# Altium schematic sheet Sheet2.SchDoc
size A2; SheetNumber: 1; SheetTotal: 1
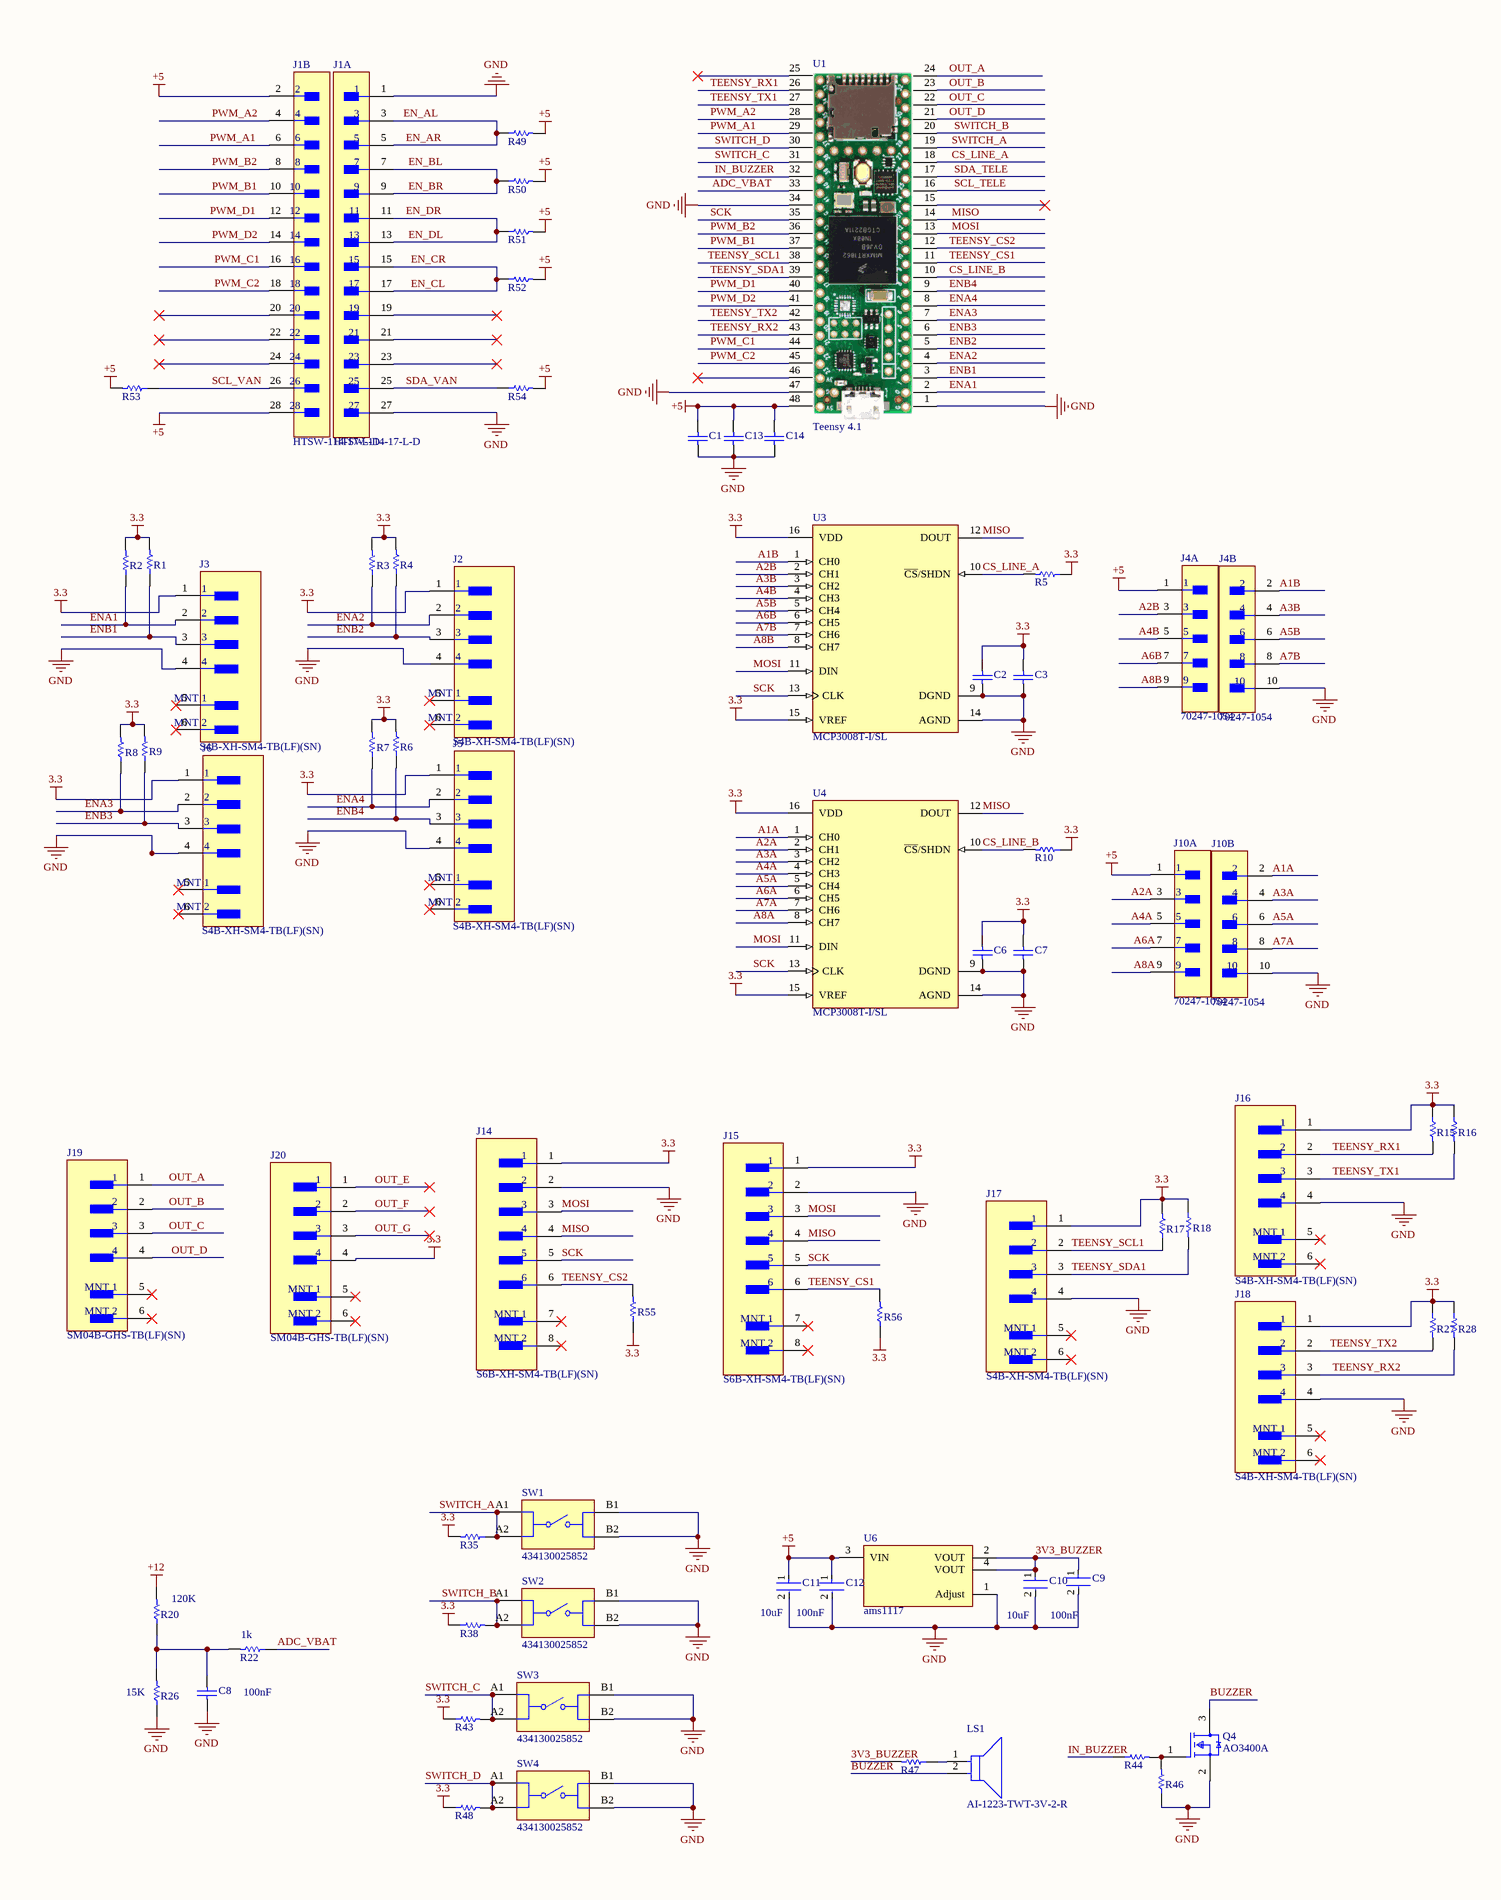
[diagram p0: Sheet2.SchDoc, left]
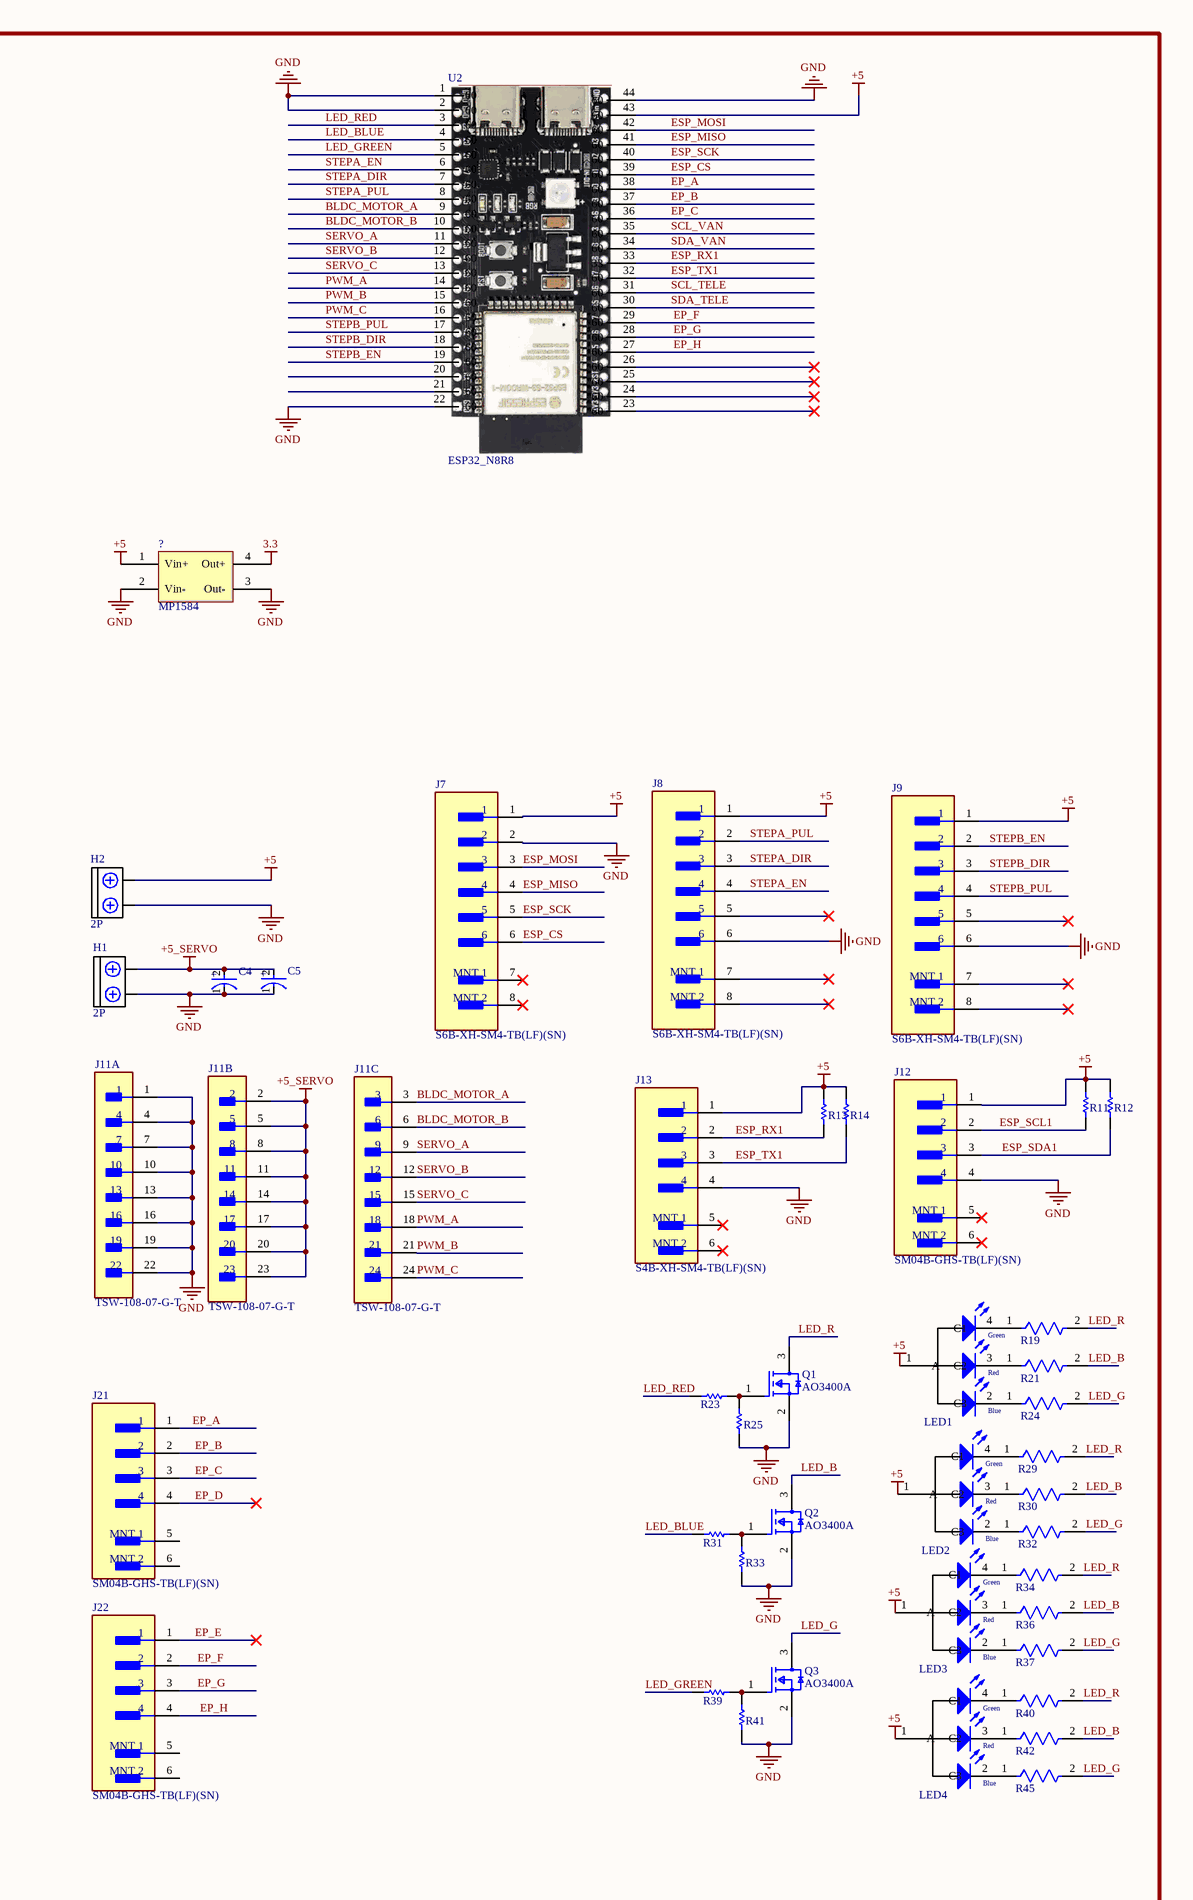
[diagram p1: Sheet2.SchDoc, right]

## Parts
?  MP1584  [MP1584]
C1  VJ0805Y104MXAMT  [CAPC2013X145X48LL20T23]  (value not drawn)
C2  VJ0805Y104MXAMT  [CAPC2013X145X48LL20T23]  (value not drawn)
C3  VJ0805Y104MXAMT  [CAPC2013X145X48LL20T23]  (value not drawn)
C4  100SXV15MX  [FP-OS-CON-SMT-F8-MFG]  (value not drawn)
C5  100SXV15MX  [FP-OS-CON-SMT-F8-MFG]  (value not drawn)
C6  VJ0805Y104MXAMT  [CAPC2013X145X48LL20T23]  (value not drawn)
C7  VJ0805Y104MXAMT  [CAPC2013X145X48LL20T23]  (value not drawn)
C8  VJ0805Y104MXAMT  [CAPC2013X145X48LL20T23]  (value not drawn)
C9  12061A101JAT2A  [FP-1206-L_3_2_0_2-W_1_6_0-MFG]  (value not drawn)
C10  12061A101JAT2A  [FP-1206-L_3_2_0_2-W_1_6_0-MFG]  (value not drawn)
C11  12061A101JAT2A  [FP-1206-L_3_2_0_2-W_1_6_0-MFG]  (value not drawn)
C12  12061A101JAT2A  [FP-1206-L_3_2_0_2-W_1_6_0-MFG]  (value not drawn)
C13  VJ0805Y104MXAMT  [CAPC2013X145X48LL20T23]  (value not drawn)
C14  VJ0805Y104MXAMT  [CAPC2013X145X48LL20T23]  (value not drawn)
H1  2P  [KF128-2P]
H2  2P  [KF128-2P]
J1  HTSW-114-17-L-D  [FP-HTSW-114-17-L-D-MFG]  (parts A,B of 2)
J2  S4B-XH-SM4-TB(LF)(SN)  [FP-S4B-XH-SM4-TB_LF_SN-MFG]
J3  S4B-XH-SM4-TB(LF)(SN)  [FP-S4B-XH-SM4-TB_LF_SN-MFG]
J4  70247-1054  [FP-70247-1054-MFG]  (parts A,B of 2)
J5  S4B-XH-SM4-TB(LF)(SN)  [FP-S4B-XH-SM4-TB_LF_SN-MFG]
J6  S4B-XH-SM4-TB(LF)(SN)  [FP-S4B-XH-SM4-TB_LF_SN-MFG]
J7  S6B-XH-SM4-TB(LF)(SN)  [FP-S6B-XH-SM4-TB_LF_SN-MFG]
J8  S6B-XH-SM4-TB(LF)(SN)  [FP-S6B-XH-SM4-TB_LF_SN-MFG]
J9  S6B-XH-SM4-TB(LF)(SN)  [FP-S6B-XH-SM4-TB_LF_SN-MFG]
J10  70247-1054  [FP-70247-1054-MFG]  (parts A,B of 2)
J11  TSW-108-07-G-T  [FP-TSW-108-07-G-T-MFG]  (parts A,B,C of 3)
J12  SM04B-GHS-TB(LF)(SN)  [FP-SM04B-GHS-TB_LF_SN-MFG]
J13  S4B-XH-SM4-TB(LF)(SN)  [FP-S4B-XH-SM4-TB_LF_SN-MFG]
J14  S6B-XH-SM4-TB(LF)(SN)  [FP-S6B-XH-SM4-TB_LF_SN-MFG]
J15  S6B-XH-SM4-TB(LF)(SN)  [FP-S6B-XH-SM4-TB_LF_SN-MFG]
J16  S4B-XH-SM4-TB(LF)(SN)  [FP-S4B-XH-SM4-TB_LF_SN-MFG]
J17  S4B-XH-SM4-TB(LF)(SN)  [FP-S4B-XH-SM4-TB_LF_SN-MFG]
J18  S4B-XH-SM4-TB(LF)(SN)  [FP-S4B-XH-SM4-TB_LF_SN-MFG]
J19  SM04B-GHS-TB(LF)(SN)  [FP-SM04B-GHS-TB_LF_SN-MFG]
J20  SM04B-GHS-TB(LF)(SN)  [FP-SM04B-GHS-TB_LF_SN-MFG]
J21  SM04B-GHS-TB(LF)(SN)  [FP-SM04B-GHS-TB_LF_SN-MFG]
J22  SM04B-GHS-TB(LF)(SN)  [FP-SM04B-GHS-TB_LF_SN-MFG]
LED1  150141M173100  [LED RGB 3528]  (value not drawn)
LED2  150141M173100  [LED RGB 3528]  (value not drawn)
LED3  150141M173100  [LED RGB 3528]  (value not drawn)
LED4  150141M173100  [LED RGB 3528]  (value not drawn)
LS1  AI-1223-TWT-3V-2-R  [FP-AI-1223-TWT-3V-2-R-MFG]
Q1  AO3400A  [FP-SOT23-MFG]
Q2  AO3400A  [FP-SOT23-MFG]
Q3  AO3400A  [FP-SOT23-MFG]
Q4  AO3400A  [FP-SOT23-MFG]
R1  CRCW08051K00FKTC  [RESC2013X50X30ML20T20]  (value not drawn)
R2  CRCW08051K00FKTC  [RESC2013X50X30ML20T20]  (value not drawn)
R3  CRCW08051K00FKTC  [RESC2013X50X30ML20T20]  (value not drawn)
R4  CRCW08051K00FKTC  [RESC2013X50X30ML20T20]  (value not drawn)
R5  CRCW08051K00FKTC  [RESC2013X50X30ML20T20]  (value not drawn)
R6  CRCW08051K00FKTC  [RESC2013X50X30ML20T20]  (value not drawn)
R7  CRCW08051K00FKTC  [RESC2013X50X30ML20T20]  (value not drawn)
R8  CRCW08051K00FKTC  [RESC2013X50X30ML20T20]  (value not drawn)
R9  CRCW08051K00FKTC  [RESC2013X50X30ML20T20]  (value not drawn)
R10  CRCW08051K00FKTC  [RESC2013X50X30ML20T20]  (value not drawn)
R11  CRCW08051K00FKTC  [RESC2013X50X30ML20T20]  (value not drawn)
R12  CRCW08051K00FKTC  [RESC2013X50X30ML20T20]  (value not drawn)
R13  CRCW08051K00FKTC  [RESC2013X50X30ML20T20]  (value not drawn)
R14  CRCW08051K00FKTC  [RESC2013X50X30ML20T20]  (value not drawn)
R15  CRCW08051K00FKTC  [RESC2013X50X30ML20T20]  (value not drawn)
R16  CRCW08051K00FKTC  [RESC2013X50X30ML20T20]  (value not drawn)
R17  CRCW08051K00FKTC  [RESC2013X50X30ML20T20]  (value not drawn)
R18  CRCW08051K00FKTC  [RESC2013X50X30ML20T20]  (value not drawn)
R19  RT0805FRE07330RL  [FP-RT0805-MFG]  (value not drawn)
R20  CRCW08051K00FKTC  [RESC2013X50X30ML20T20]  (value not drawn)
R21  RT0805FRE07330RL  [FP-RT0805-MFG]  (value not drawn)
R22  CRCW08051K00FKTC  [RESC2013X50X30ML20T20]  (value not drawn)
R23  CRCW08051K00FKTC  [RESC2013X50X30ML20T20]  (value not drawn)
R24  RT0805FRE07330RL  [FP-RT0805-MFG]  (value not drawn)
R25  CRCW08051K00FKTC  [RESC2013X50X30ML20T20]  (value not drawn)
R26  CRCW08051K00FKTC  [RESC2013X50X30ML20T20]  (value not drawn)
R27  CRCW08051K00FKTC  [RESC2013X50X30ML20T20]  (value not drawn)
R28  CRCW08051K00FKTC  [RESC2013X50X30ML20T20]  (value not drawn)
R29  RT0805FRE07330RL  [FP-RT0805-MFG]  (value not drawn)
R30  RT0805FRE07330RL  [FP-RT0805-MFG]  (value not drawn)
R31  CRCW08051K00FKTC  [RESC2013X50X30ML20T20]  (value not drawn)
R32  RT0805FRE07330RL  [FP-RT0805-MFG]  (value not drawn)
R33  CRCW08051K00FKTC  [RESC2013X50X30ML20T20]  (value not drawn)
R34  RT0805FRE07330RL  [FP-RT0805-MFG]  (value not drawn)
R35  CRCW08051K00FKTC  [RESC2013X50X30ML20T20]  (value not drawn)
R36  RT0805FRE07330RL  [FP-RT0805-MFG]  (value not drawn)
R37  RT0805FRE07330RL  [FP-RT0805-MFG]  (value not drawn)
R38  CRCW08051K00FKTC  [RESC2013X50X30ML20T20]  (value not drawn)
R39  CRCW08051K00FKTC  [RESC2013X50X30ML20T20]  (value not drawn)
R40  RT0805FRE07330RL  [FP-RT0805-MFG]  (value not drawn)
R41  CRCW08051K00FKTC  [RESC2013X50X30ML20T20]  (value not drawn)
R42  RT0805FRE07330RL  [FP-RT0805-MFG]  (value not drawn)
R43  CRCW08051K00FKTC  [RESC2013X50X30ML20T20]  (value not drawn)
R44  CRCW08051K00FKTC  [RESC2013X50X30ML20T20]  (value not drawn)
R45  RT0805FRE07330RL  [FP-RT0805-MFG]  (value not drawn)
R46  CRCW08051K00FKTC  [RESC2013X50X30ML20T20]  (value not drawn)
R47  CRCW08051K00FKTC  [RESC2013X50X30ML20T20]  (value not drawn)
R48  CRCW08051K00FKTC  [RESC2013X50X30ML20T20]  (value not drawn)
R49  CRCW08051K00FKTC  [RESC2013X50X30ML20T20]  (value not drawn)
R50  CRCW08051K00FKTC  [RESC2013X50X30ML20T20]  (value not drawn)
R51  CRCW08051K00FKTC  [RESC2013X50X30ML20T20]  (value not drawn)
R52  CRCW08051K00FKTC  [RESC2013X50X30ML20T20]  (value not drawn)
R53  CRCW08051K00FKTC  [RESC2013X50X30ML20T20]  (value not drawn)
R54  CRCW08051K00FKTC  [RESC2013X50X30ML20T20]  (value not drawn)
R55  CRCW08051K00FKTC  [RESC2013X50X30ML20T20]  (value not drawn)
R56  CRCW08051K00FKTC  [RESC2013X50X30ML20T20]  (value not drawn)
SW1  434130025852  [434130025852]
SW2  434130025852  [434130025852]
SW3  434130025852  [434130025852]
SW4  434130025852  [434130025852]
U1  Teensy 4.1  [Teensy 4.1]
U2  ESP32_N8R8  [DIP44]
U3  MCP3008T-I/SL  [FP-C04-108-MFG]
U4  MCP3008T-I/SL  [FP-C04-108-MFG]
U6  ams1117  [FP-ams1117-IPC_C]

## Nets
3.3: ?.4(Out+) C2.2 C3.2 C6.2 C7.2 J2.1 J3.1 J5.1 J6.1 J14.1 J15.1 J16.1 J17.1 J18.1 J20.4 R1.2 R2.2 R3.2 R4.2 R5.1 R6.2 R7.2 R8.2 R9.2 R10.1 R15.1 R16.1 R17.2 R18.1 R27.1 R28.1 R35.2 R38.1 R43.1 R48.1 R55.1 R56.1 U3.15(VREF) U3.16(VDD) U4.15(VREF) U4.16(VDD)
+5: ?.1(Vin+) C1.2 C11.1 C12.1 C13.2 C14.2 H2.2 J1.2 J1.28 J4.1 J7.1 J8.1 J9.1 J10.1 J12.1 J13.1 LED1.1(A) LED2.1(A) LED3.1(A) LED4.1(A) R11.1 R12.1 R13.1 R14.1 R49.2 R50.2 R51.2 R52.2 R53.2 R54.2 U1.48 U2.43(60) U6.3(VIN)
+5_SERVO: C4.2(A) C5.2(A) H1.2 J11.2 J11.5 J11.8 J11.11 J11.14 J11.17 J11.20 J11.23
+12: R20.2
GND: ?.2(Vin-) ?.3(Out-) C1.1 C2.1 C3.1 C4.1(C) C5.1(C) C6.1 C7.1 C8.1 C9.2 C10.2 C11.2 C12.2 C13.1 C14.1 H1.1 H2.1 J1.1 J1.27 J2.4 J3.4 J4.10 J5.4 J6.4 J7.2 J8.6 J9.6 J10.10 J11.1 J11.4 J11.7 J11.10 J11.13 J11.16 J11.19 J11.22 J12.4 J13.4 J14.2 J15.2 J16.4 J17.4 J18.4 Q1.2(S) Q2.2(S) Q3.2(S) Q4.2(S) R25.1 R26.1 R33.1 R41.1 R46.1 SW1.B1 SW1.B2 SW2.B1 SW2.B2 SW3.B1 SW3.B2 SW4.B1 SW4.B2 U1.1(GND) U1.34 U1.47 U2.1(60) U2.2(60) U2.22(60) U2.44(60) U3.9(DGND) U3.14(AGND) U4.9(DGND) U4.14(AGND) U6.1(Adjust)
3V3_BUZZER: C9.1 C10.1 R47.2 U6.2(VOUT) U6.4(VOUT)
A1A: J10.2 U4.1(CH0)
A1B: J4.2 U3.1(CH0)
A2A: J10.3 U4.2(CH1)
A2B: J4.3 U3.2(CH1)
A3A: J10.4 U4.3(CH2)
A3B: J4.4 U3.3(CH2)
A4A: J10.5 U4.4(CH3)
A4B: J4.5 U3.4(CH3)
A5A: J10.6 U4.5(CH4)
A5B: J4.6 U3.5(CH4)
A6A: J10.7 U4.6(CH5)
A6B: J4.7 U3.6(CH5)
A7A: J10.8 U4.7(CH6)
A7B: J4.8 U3.7(CH6)
A8A: J10.9 U4.8(CH7)
A8B: J4.9 U3.8(CH7)
ADC_VBAT: R22.1 U1.33
BLDC_MOTOR_A: J11.3 U2.9(60)
BLDC_MOTOR_B: J11.6 U2.10(60)
BUZZER: LS1.2(A) Q4.3(D)
CS_LINE_A: R5.2 U1.18 U3.10(~{CS}/SHDN)
CS_LINE_B: R10.2 U1.10 U4.10(~{CS}/SHDN)
EN_AL: J1.3 J1.5 R49.1  [also labelled EN_AR]
EN_BL: J1.7 J1.9 R50.1  [also labelled EN_BR]
EN_CL: J1.15 J1.17 R52.1  [also labelled EN_CR]
EN_DL: J1.11 J1.13 R51.1  [also labelled EN_DR]
ENA1: J3.2 R2.1 U1.2
ENA2: J2.2 R3.1 U1.4
ENA3: J6.2 R8.1 U1.7
ENA4: J5.2 R7.1 U1.8
ENB1: J3.3 R1.1 U1.3
ENB2: J2.3 R4.1 U1.5
ENB3: J6.3 R9.1 U1.6
ENB4: J5.3 R6.1 U1.9
EP_A: J21.1 U2.38(60)
EP_B: J21.2 U2.37(60)
EP_C: J21.3 U2.36(60)
EP_D: J21.4
EP_E: J22.1
EP_F: J22.2 U2.29(60)
EP_G: J22.3 U2.28(60)
EP_H: J22.4 U2.27(60)
ESP_CS: J7.6 U2.39(60)
ESP_MISO: J7.4 U2.41(60)
ESP_MOSI: J7.3 U2.42(60)
ESP_RX1: J13.2 R13.2 U2.33
ESP_SCK: J7.5 U2.40(60)
ESP_SCL1: J12.2 R11.2
ESP_SDA1: J12.3 R12.2
ESP_TX1: J13.3 R14.2 U2.32(60)
IN_BUZZER: R44.1 U1.32
LED_B: Q2.3(D) R21.2 R30.2 R36.2 R42.2
LED_BLUE: R31.1 U2.4(60)
LED_G: Q3.3(D) R24.2 R32.2 R37.2 R45.2
LED_GREEN: R39.1 U2.5(60)
LED_R: Q1.3(D) R19.2 R29.2 R34.2 R40.2
LED_RED: R23.1 U2.3(60)
MISO: J14.4 J15.4 U1.14 U3.12(DOUT) U4.12(DOUT)
MOSI: J14.3 J15.3 U1.13 U3.11(DIN) U4.11(DIN)
OUT_A: J19.1 U1.24
OUT_B: J19.2 U1.23
OUT_C: J19.3 U1.22
OUT_D: J19.4 U1.21
OUT_E: J20.1
OUT_F: J20.2
OUT_G: J20.3
PWM_A: J11.18 U2.14(60)
PWM_A1: J1.6 U1.29
PWM_A2: J1.4 U1.28
PWM_B: J11.21 U2.15(60)
PWM_B1: J1.10 U1.37
PWM_B2: J1.8 U1.36
PWM_C: J11.24 U2.16(60)
PWM_C1: J1.16 U1.44
PWM_C2: J1.18 U1.45
PWM_D1: J1.12 U1.40
PWM_D2: J1.14 U1.41
SCK: J14.5 J15.5 U1.35 U3.13(CLK) U4.13(CLK)
SCL_TELE: U1.16 U2.31(60)
SCL_VAN: J1.26 R53.1 U2.35(60)
SDA_TELE: U1.17 U2.30(60)
SDA_VAN: J1.25 R54.1 U2.34(60)
SERVO_A: J11.9 U2.11(60)
SERVO_B: J11.12 U2.12(60)
SERVO_C: J11.15 U2.13(60)
STEPA_DIR: J8.3 U2.7(60)
STEPA_EN: J8.4 U2.6(60)
STEPA_PUL: J8.2 U2.8(60)
STEPB_DIR: J9.3 U2.18(60)
STEPB_EN: J9.2 U2.19(60)
STEPB_PUL: J9.4 U2.17(60)
SWITCH_A: R35.1 SW1.A1 SW1.A2 U1.19
SWITCH_B: R38.2 SW2.A1 SW2.A2 U1.20
SWITCH_C: R43.2 SW3.A1 SW3.A2 U1.31
SWITCH_D: R48.2 SW4.A1 SW4.A2 U1.30
TEENSY_CS1: J15.6 R56.2 U1.11
TEENSY_CS2: J14.6 R55.2 U1.12
TEENSY_RX1: J16.2 R15.2 U1.26
TEENSY_RX2: J18.3 R28.2 U1.43
TEENSY_SCL1: J17.2 R17.1 U1.38
TEENSY_SDA1: J17.3 R18.2 U1.39
TEENSY_TX1: J16.3 R16.2 U1.27
TEENSY_TX2: J18.2 R27.2 U1.42
NetC8_2: C8.2 R20.1 R22.2 R26.2
NetLED1_2: LED1.2(C3) R24.1
NetLED1_3: LED1.3(C2) R21.1
NetLED1_4: LED1.4(C1) R19.1
NetLED2_2: LED2.2(C3) R32.1
NetLED2_3: LED2.3(C2) R30.1
NetLED2_4: LED2.4(C1) R29.1
NetLED3_2: LED3.2(C3) R37.1
NetLED3_3: LED3.3(C2) R36.1
NetLED3_4: LED3.4(C1) R34.1
NetLED4_2: LED4.2(C3) R45.1
NetLED4_3: LED4.3(C2) R42.1
NetLED4_4: LED4.4(C1) R40.1
NetLS1_1: LS1.1(C) R47.1
NetQ1_1: Q1.1(G) R23.2 R25.2
NetQ2_1: Q2.1(G) R31.2 R33.2
NetQ3_1: Q3.1(G) R39.2 R41.2
NetQ4_1: Q4.1(G) R44.2 R46.2

Not connected (* = marked no-connect by the designer): J1 19* 20* 21* 22* 23* 24*; J2 5(MNT_1)* 6(MNT_2)*; J3 5(MNT_1)* 6(MNT_2)*; J5 5(MNT_1)* 6(MNT_2)*; J6 5(MNT_1)* 6(MNT_2)*; J7 7(MNT_1)* 8(MNT_2)*; J8 5* 7(MNT_1)* 8(MNT_2)*; J9 5* 7(MNT_1)* 8(MNT_2)*; J12 5(MNT_1)* 6(MNT_2)*; J13 5(MNT_1)* 6(MNT_2)*; J14 7(MNT_1)* 8(MNT_2)*; J15 7(MNT_1)* 8(MNT_2)*; J16 5(MNT_1)* 6(MNT_2)*; J17 5(MNT_1)* 6(MNT_2)*; J18 5(MNT_1)* 6(MNT_2)*; J19 5(MNT_1)* 6(MNT_2)*; J20 5(MNT_1)* 6(MNT_2)*; J21 5(MNT_1) 6(MNT_2); J22 5(MNT_1) 6(MNT_2); U1 15(65)* 25(65)* 46(65)*; U2 20(60) 21(60) 23(60)* 24(60)* 25(60)* 26(60)*

## Notes on the sheet
- (near R20) 120K
- (near C11) 10uF
- 100nF
- (near C10) 10uF
- (near R22) 1k
- (near R26) 15K
- (in symbol CMP-05428-000606-1) +
- (in symbol LED RGB SMD) Green; Red; Blue

## Library data of the parts
C1-C3 C6-C8 C13 C14 = CMP-2007-01796-1: Manufacturer: Vitramon; Part Number: VJ0805Y104MXAMT
C4 C5 = CMP-05428-000606-1: Conductive Polymer Aluminum Solid Capacitors (OS-CON) 15uF ±20% 100V RADIAL SMT 10x7.9mm; ESR (Equivalent Series Resistance): 60mR; Life (Hours): 1000Hour; Series: OS-CON™, SXV; Capacitance: 15uF; Tolerance: 20%; Voltage Rating: 100V; Min Operating Temperature: -55°C; Packaging: Cut Tape; Mount: Surface Mount; Max Operating Temperature: 125°C; Case/Package: Radial
C9-C12 = CMP-04427-007664-1: General Purpose Ceramic Capacitor, 1206, 100pF, 5%, NP0, 30ppm/°C, 100V; Dielectric: C0G; Insulation Resistance: 100GR; Voltage: 63V; Max Operating Temperature: 125°C; Termination: SMD/SMT; Radiation Hardening: No; Capacitance: 100pF; Voltage Rating: 100V; Thickness: 0.037inch; Temperature Coefficient: 30ppm/°C; Mount: Surface Mount; REACH SVHC: No SVHC; Case Code (Imperial): 1206; Voltage Rating (DC): 100V; Lead Free: Lead Free; RoHS Compliant: Yes; Height: 0.94mm; Number of Pins: 2; Case/Package: 1206; Package Quantity: 1; Series: -; Construction: Flat; Contact Plating: Tin; Tolerance: 5%; Length: 3.2mm; Min Operating Temperature: -55°C; Width: 0.063inch; Packaging: Tape and Reel; Case Code (Metric): 3216; Depth: 1.6mm
H1 H2 = KF-128-2P: DOMINO 5.08MM
J1 = CMP-02766-000075-1: CONN HEADER VERT 28POS 2.54MM; Manufacturer: Samtec; Conn Gender: Male; Current Rating: 4.6A; Voltage Rating: 450V; Number Of Contacts: 28; Conn Orientation: Vertical; Lead Free: Yes; Category: Conn; Device Class L3: unset; Octopart: https://octopart.com/htsw-114-17-l-d-samtec-10679119; RoHS: TRUE; Package: 0; Digikey Description: CONN HEADER VERT 28POS 2.54MM; Device Class L2: Headers and Wire Housings; ComponentLink2Description: Datasheet; ComponentLink2URL: http://suddendocs.samtec.com/prints/htsw-xxx-xx-xxx-x-xx-xx-xx-mkt.pdf; Pitch: 2.54mm; Footprint Url: http://suddendocs.samtec.com/prints/htsw-xxx-xx-xxx-x-xx-xx-xx-footprint.pdf; Manufacturer Part Number: HTSW-114-17-L-D; Temperature: -55°C to +125°C; Temperature Range High: +125°C; Device Class L1: Connectors; Automotive: No; Contact Material: Gold,Nickel; Number Of Rows: 2; Height: 18.62mm; Temperature Range Low: -55°C
J2 J3 J5 J6 J13 J16-J18 = CMP-17439-000072-1: CONN HEADER SMD R/A 4POS 2.5MM; Number of Positions: 4; Max Current Rating: 3A; Max Voltage Rating (AC): 250V; Connector Type: Male Pin; Contact Resistance: 20mR; Gender: Male; Pitch: 0.098inch; Max Operating Temperature: 85°C; Contact Plating: Tin; Housing Material: Polyamide; Housing Color: Beige; Depth: 10mm; Series: XH; Package Quantity: 1; Length: 15mm; Contact Material: Copper Alloy; Min Operating Temperature: -25°C; REACH SVHC: No SVHC; Orientation: Right Angle; Number of Rows: 1; Contact Type: Male Pin; Color: Natural; Lead Free: Lead Free; Termination: Solder; Mount: Surface Mount; Number of Contacts: 4; Packaging: Tape and Reel
J4 J10 = CMP-00257-07673580-1: 70247-1054 Conn Shrouded Header (4 Sides) HDR 10 POS 2.54mm Solder RA Side Entry Thru-Hole C-Grid Tray; Manufacturer Lifecycle Status: ACTIVE; Max Voltage Rating (DC): 250V; Gender: Male; Number of Circuits: 10; Current Rating: 2.5A; Lead Length: 3.05mm; Glow Wire Compliant: Non-compliant; Mating Post Length: 6.1mm; Plating: Tin; NexarPartId: 7673580; REACH SVHC: Unknown; Voltage Rating: 250V; Housing Material: Polyester; Contact Material: Gold; Number of Contacts: 10; Pitch: 2.54mm; Termination: Through Hole; Row Spacing: 2.54mm; Connector Type: Header; Lifecycle Status: Production; Number of Rows: 2; Max Operating Temperature: 120°C; RoHS: Compliant; Country of Origin: SK; ELV: Compliant; Voltage Rating (DC): 250V; Radiation Hardening: No; Orientation: Right Angle; Contact Plating: Gold; Min Operating Temperature: -55°C; Material: Polyester; Mount: Through Hole; Height: 9.09mm; Number of Positions: 10; Flammability Rating: UL94 V-0; Contact Gender: Male
J7-J9 J14 J15 = CMP-17439-000164-1: CONN HEADER SMD R/A 6POS 2.5MM; Gender: Male; Number of Positions: 6; Max Current Rating: 3A; Voltage Rating: 250V; Contact Resistance: 20mR; Flammability Rating: UL94 V-0; Orientation: Right Angle; Contact Finish - Mating: TIN; Packaging: Tape and Reel; Termination: Solder; Pitch: 2.5mm; Housing Color: Beige; Insulation Material: Nylon; Fastening Type: Detent; Housing Material: Polyamide; Package Quantity: 1; Mount: Surface Mount; Insulation Color: Natural; Series: XH; Depth: 7mm; Contact Shape: Square; Color: Natural; Max Voltage Rating (AC): 250V; Min Operating Temperature: -25°C; Number of Contacts: 6; Lead Free: Lead Free; Contact Material: Copper Alloy; Contact Type: Male Pin; Length: 20mm; Max Operating Temperature: 85°C; Connector Type: Header; Number of Rows: 1; REACH SVHC: No SVHC; Contact Plating: Copper
J11 = CMP-02766-000095-1: CONN HEADER VERT 24POS 2.54MM; Max Voltage Rating (AC): 550V; Number of Positions: 24; Row Spacing: 0.1inch; Connector Type: Male Pin; Max Current Rating: 7.6A; Gender: Male; Depth: 7.62mm; Packaging: Rail/Tube; Number of Contacts: 24; Package Quantity: 1; Lead Free: Lead Free; Number of Rows: 3; REACH SVHC: No SVHC; Housing Material: Polyester; Contact Plating: Gold; Mount: Through Hole; Pitch: 2.54mm; Housing Color: Black; Contact Material: Bronze; Min Operating Temperature: -55°C; Max Operating Temperature: 125°C; Length: 20.32mm; Termination: Solder; Color: Black; Contact Mating Length: 0.23inch; Radiation Hardening: No; Orientation: Straight
J12 J19-J22 = CMP-17439-000411-1: CONN HEADER SMD R/A 4POS 1.25MM; Voltage Rating: 50V; Number of Contacts: 4; Current Rating: 1A; Termination: Solder; Mount: Surface Mount; REACH SVHC: No SVHC; Packaging: Cut Tape; Contact Material: Bronze; Series: GH; Orientation: Right Angle; Lead Free: Lead Free; Housing Material: Nylon; Contact Plating: Tin; Housing Color: Natural; Number of Rows: 1; Pitch: 1.25mm; Number of Positions: 4
LED1-LED4 = LED RGB SMD: SMD Full-Color Top LED, WL-SFTW, Red & Green & Blue; Manufacturer: Würth Elektronik eiSos GmbH; PartNo: 150141M173100; ComponentLink1Description: Manufacturer; ComponentLink1URL: http://www.we-online.de; Created by: Christin Otto; Created Date: June 2013; ComponentLink2Description: Datasheet; ComponentLink2URL: http://katalog.we-online.com/led/datasheet/150141M173100.pdf; Color: Red & Green & Blue
LS1 = CMP-103888-000003-1: BUZZER MAGNETIC 3V 12MM TH; Min Supply Voltage (DC): 2V; Operating Supply Current: 30mA; Max Supply Voltage (DC): 4V; Input Type: DC; Frequency: 2.3kHz; Series: AI; Nominal Supply Voltage (DC): 3V; Packaging: Tray; Max Operating Temperature: 70°C; Height: 7.5mm; Termination: PC Pins; Max Supply Current: 30mA; Mount: Through Hole; Diameter: 12mm; Voltage Rating: 3V; Sensing Method: Magnetic; Min Operating Temperature: -20°C; Contact Plating: Tin
Q1-Q4 = CMP-83955-000006-1: MOSFET N-CH 30V 5.7A SOT23; Input Capacitance: 630pF; Number of Elements: 1; Rds On Max: 26.5mR; Max Power Dissipation: 1.4W; Gate to Source Voltage (Vgs): 12V; Min Operating Temperature: -55°C; Lead Free: Lead Free; Number of Pins: 3; Drain to Source Voltage (Vdss): 30V; Case/Package: SOT-23; Mount: Surface Mount; Continuous Drain Current (ID): 5.7A; Radiation Hardening: No; Packaging: Tape and Reel; Max Operating Temperature: 150°C; Power Dissipation: 1.4W
R1-R18 R23 R25 R27 R28 R31 R33 R39 R41 R44 R46 R47 R49-R54 = CMP-2001-04268-1: Manufacturer: Vishay Dale; Part Number: CRCW08051K00FKTC
R19 R21 R24 R29 R30 R32 R34 R36 R37 R40 R42 R45 = CMP-03412-000042-1: Res Thin Film 0805 330K Ohm 1% 1/8W ±50ppm/°C Molded SMD SMD Paper T/R; Manufacturer: Yageo; Resistance: 330Ω; Value: 330Ω; Power Rating: 0.125W; Tolerance: 0.0001; Voltage Rating: 150V; Manufacturer Part Number: RT0805FRE07330RL; Height: 0.6mm; Octopart: https://octopart.com/rt0805fre07330rl-yageo-39785396; Package: RT0805; Temperature: -55°C to +155°C; Category: Res; RoHS: TRUE; ComponentLink2Description: Datasheet; Automotive: No; Device Class L3: Chip SMD Resistors; Temperature Range High: +155°C; Device Class L1: Passive Components; Temperature Coefficient: 50 ppm/°C; Series: RT; Composition: Thin Film; Digikey Description: Res Thin Film 0805 330K Ohm 1% 1/8W ±50ppm/°C Molded SMD SMD Paper T/R; Mouser Description: Res Thin Film 0805 330K Ohm 1% 1/8W ±50ppm/°C Molded SMD SMD Paper T/R; Device Class L2: Resistors; Temperature Range Low: -55°C; Ipc Land Pattern Name: RESC200125X50; Lead Free: Yes; ComponentLink2URL: http://www.yageo.com/documents/recent/PYu-RT_1-to-0.01_RoHS_L_9.pdf; Footprint Url: http://www.yageo.com/exep/pages/download/literatures/PYu-R_Mount_10.pdf
R20 R22 R55 R56 = CMP-2001-04268-1: 100K; Manufacturer: Vishay Dale; Part Number: CRCW08051K00FKTC
R26 R35 R38 R43 R48 = CMP-2001-04268-1: 15K; Manufacturer: Vishay Dale; Part Number: CRCW08051K00FKTC
SW1-SW4 = CMP-03913-161056523-3: Tactile Sw, Spst-No, 0.05A, 16Vdc, 520Gf Rohs Compliant: Yes; Manufacturer Lifecycle Status: ACTIVE; Voltage Rating: 16V; Insulation Resistance: 100MΩ; Current Rating: 50mA; YEOL: 1 = Estimated lifetime > 10 years; Min Operating Temperature: -40°C; Lifecycle Status: Production; RoHS: Compliant; Height: 2.5mm; Contact Plating: Silver; Packaging: Tape and Reel; Max Operating Temperature: 85°C
U3 U4 = CMP-0188-00351-3: IC ADC 10BIT SAR 16SOIC; Resolution: 10b; Output Voltage: 4.1V; Number of Channels: 8; Number of Elements: 1; Number of Bits: 10; Full Scale Error: 1LSB; Signal to Noise Ratio (SNR): 200dB; Interface: SPI; Nominal Supply Current: 425uA; Sampling Rate: 200KS/s; Supply Type: Single; Min Supply Voltage: 2.7V; Max Supply Voltage: 5.5V; Operating Supply Voltage: 5V; Polarity: Unipolar; Min Operating Temperature: -40°C; REACH SVHC: No SVHC; Integral Nonlinearity (INL): 1LSB; Mount: Surface Mount; Number of Converters: 1; Differential Nonlinearity: 1LSB; Contact Plating: Tin; Lead Free: Lead Free; Conversion Rate: 200KS/s; Radiation Hardening: No; Max Operating Temperature: 85°C; Case/Package: SOIC; Package Quantity: 2600; Number of Pins: 16; Packaging: Tape and Reel; Number of A/D Converters: 1
U6 = CMP-209535-000002-1: 1A LOW DROPOUT VOLTAGE REGULATOR; RoHS Compliant: Yes